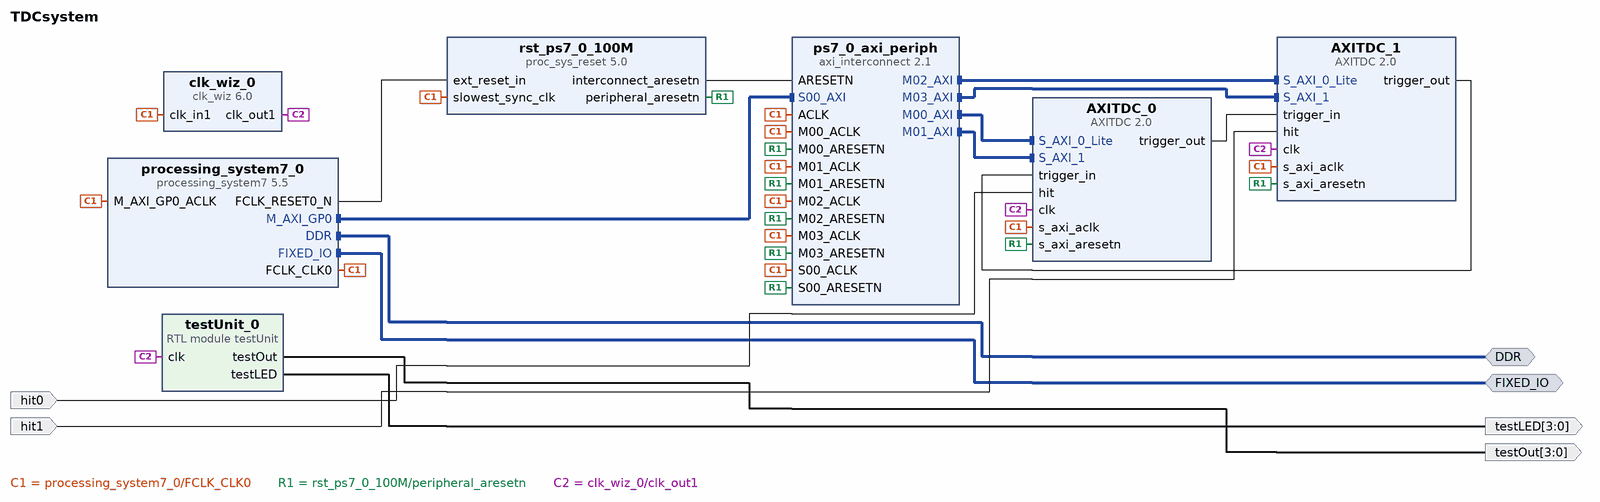
[diagram p0: block diagram of the top level]
# Vivado block design TDCsystem, xc7z010clg400-1, Vivado 2018.2
create_bd_design TDCsystem

create_bd_intf_port -mode Master -vlnv xilinx.com:interface:ddrx_rtl:1.0 DDR
create_bd_intf_port -mode Master -vlnv xilinx.com:display_processing_system7:fixedio_rtl:1.0 FIXED_IO
create_bd_port -dir I hit0
create_bd_port -dir I hit1
create_bd_port -dir O -from 3 -to 0 testOut
create_bd_port -dir O -from 3 -to 0 testLED

create_bd_cell -type ip -vlnv xilinx.com:ip:processing_system7:5.5 processing_system7_0
set_property -dict [list \
  CONFIG.PCW_UIPARAM_DDR_FREQ_MHZ 533.333333 \
  CONFIG.PCW_FPGA0_PERIPHERAL_FREQMHZ 100 \
  CONFIG.PCW_UIPARAM_DDR_MEMORY_TYPE {DDR 3 (Low Voltage)} \
  CONFIG.PCW_UIPARAM_DDR_PARTNO {MT41K256M16 RE-125} \
] [get_bd_cells processing_system7_0]
# 32 more settings of processing_system7_0 are not shown: defaults, MIO pin electricals, DDR timing, and values the tool derives
create_bd_cell -type ip -vlnv Michel:user:AXITDC:2.0 AXITDC_0
create_bd_cell -type ip -vlnv Michel:user:AXITDC:2.0 AXITDC_1
create_bd_cell -type ip -vlnv xilinx.com:ip:axi_interconnect:2.1 ps7_0_axi_periph
set_property -dict {CONFIG.NUM_MI 4} [get_bd_cells ps7_0_axi_periph]
create_bd_cell -type ip -vlnv xilinx.com:ip:proc_sys_reset:5.0 rst_ps7_0_100M
create_bd_cell -type ip -vlnv xilinx.com:ip:clk_wiz:6.0 clk_wiz_0
set_property -dict [list \
  CONFIG.CLKOUT1_REQUESTED_OUT_FREQ 350.000 \
  CONFIG.USE_LOCKED false \
  CONFIG.USE_RESET false \
  CONFIG.MMCM_DIVCLK_DIVIDE 2 \
  CONFIG.MMCM_CLKFBOUT_MULT_F 20.125 \
  CONFIG.MMCM_CLKOUT0_DIVIDE_F 2.875 \
  CONFIG.CLKOUT1_JITTER 125.750 \
  CONFIG.CLKOUT1_PHASE_ERROR 163.922 \
] [get_bd_cells clk_wiz_0]
create_bd_cell -type module -reference testUnit testUnit_0
set_property -dict {CONFIG.BITS 18} [get_bd_cells testUnit_0]

# ---- connections ----

connect_bd_intf_net [get_bd_intf_pins processing_system7_0/M_AXI_GP0] [get_bd_intf_pins ps7_0_axi_periph/S00_AXI]
connect_bd_intf_net [get_bd_intf_pins ps7_0_axi_periph/M00_AXI] [get_bd_intf_pins AXITDC_0/S_AXI_0_Lite]
connect_bd_intf_net [get_bd_intf_pins ps7_0_axi_periph/M01_AXI] [get_bd_intf_pins AXITDC_0/S_AXI_1]
connect_bd_intf_net [get_bd_intf_pins ps7_0_axi_periph/M02_AXI] [get_bd_intf_pins AXITDC_1/S_AXI_0_Lite]
connect_bd_intf_net [get_bd_intf_pins ps7_0_axi_periph/M03_AXI] [get_bd_intf_pins AXITDC_1/S_AXI_1]
connect_bd_intf_net [get_bd_intf_ports DDR] [get_bd_intf_pins processing_system7_0/DDR]
connect_bd_intf_net [get_bd_intf_ports FIXED_IO] [get_bd_intf_pins processing_system7_0/FIXED_IO]
connect_bd_net [get_bd_pins processing_system7_0/FCLK_CLK0] \
  [get_bd_pins processing_system7_0/M_AXI_GP0_ACLK] [get_bd_pins rst_ps7_0_100M/slowest_sync_clk] \
  [get_bd_pins AXITDC_0/s_axi_aclk] [get_bd_pins AXITDC_1/s_axi_aclk] [get_bd_pins clk_wiz_0/clk_in1] \
  [get_bd_pins ps7_0_axi_periph/S00_ACLK] [get_bd_pins ps7_0_axi_periph/M00_ACLK] [get_bd_pins ps7_0_axi_periph/ACLK] \
  [get_bd_pins ps7_0_axi_periph/M01_ACLK] [get_bd_pins ps7_0_axi_periph/M02_ACLK] [get_bd_pins ps7_0_axi_periph/M03_ACLK]
connect_bd_net [get_bd_pins processing_system7_0/FCLK_RESET0_N] [get_bd_pins rst_ps7_0_100M/ext_reset_in]
connect_bd_net [get_bd_pins rst_ps7_0_100M/peripheral_aresetn] \
  [get_bd_pins AXITDC_0/s_axi_aresetn] [get_bd_pins AXITDC_1/s_axi_aresetn] [get_bd_pins ps7_0_axi_periph/S00_ARESETN] \
  [get_bd_pins ps7_0_axi_periph/M00_ARESETN] [get_bd_pins ps7_0_axi_periph/M01_ARESETN] \
  [get_bd_pins ps7_0_axi_periph/M02_ARESETN] [get_bd_pins ps7_0_axi_periph/M03_ARESETN]
connect_bd_net [get_bd_pins rst_ps7_0_100M/interconnect_aresetn] [get_bd_pins ps7_0_axi_periph/ARESETN]
connect_bd_net [get_bd_pins clk_wiz_0/clk_out1] [get_bd_pins AXITDC_0/clk] [get_bd_pins AXITDC_1/clk] [get_bd_pins testUnit_0/clk]
connect_bd_net -net hit0_1 [get_bd_ports hit0] [get_bd_pins AXITDC_0/hit]
connect_bd_net -net hit1_1 [get_bd_ports hit1] [get_bd_pins AXITDC_1/hit]
connect_bd_net [get_bd_pins AXITDC_1/trigger_out] [get_bd_pins AXITDC_0/trigger_in]
connect_bd_net [get_bd_pins AXITDC_0/trigger_out] [get_bd_pins AXITDC_1/trigger_in]
connect_bd_net [get_bd_pins testUnit_0/testOut] [get_bd_ports testOut]
connect_bd_net [get_bd_pins testUnit_0/testLED] [get_bd_ports testLED]

# ---- address map ----
assign_bd_address -offset 0x43C00000 -range 4K -target_address_space [get_bd_addr_spaces processing_system7_0/Data] [get_bd_addr_segs AXITDC_0/S_AXI_0_Lite/reg0]
assign_bd_address -offset 0x43C10000 -range 16K -target_address_space [get_bd_addr_spaces processing_system7_0/Data] [get_bd_addr_segs AXITDC_0/S_AXI_1/mem1]
assign_bd_address -offset 0x43C20000 -range 4K -target_address_space [get_bd_addr_spaces processing_system7_0/Data] [get_bd_addr_segs AXITDC_1/S_AXI_0_Lite/reg0]
assign_bd_address -offset 0x43C30000 -range 16K -target_address_space [get_bd_addr_spaces processing_system7_0/Data] [get_bd_addr_segs AXITDC_1/S_AXI_1/mem1]

validate_bd_design
save_bd_design
